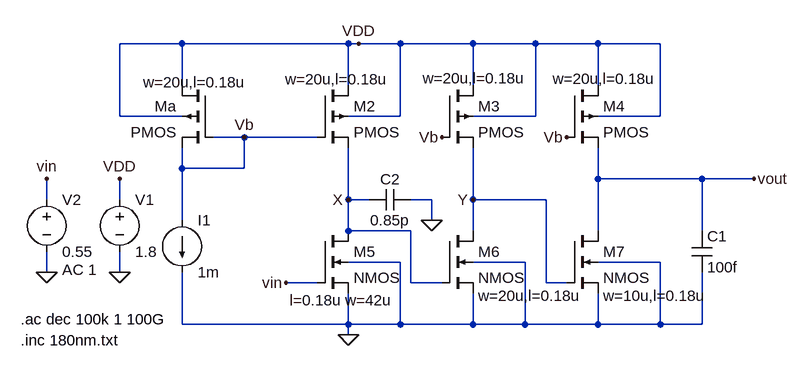
[diagram p0: schematic q4.asc]
q4.asc, the LTspice schematic file:
Version 4
SHEET 1 964 680
WIRE -112 -176 -208 -176
WIRE 144 -176 -112 -176
WIRE 160 -176 144 -176
WIRE 224 -176 160 -176
WIRE 336 -176 224 -176
WIRE 432 -176 336 -176
WIRE 528 -176 432 -176
WIRE 624 -176 528 -176
WIRE -112 -112 -112 -176
WIRE 144 -112 144 -176
WIRE 336 -112 336 -176
WIRE 528 -112 528 -176
WIRE -208 -64 -208 -176
WIRE -112 -64 -208 -64
WIRE 224 -64 224 -176
WIRE 224 -64 144 -64
WIRE 432 -64 432 -176
WIRE 432 -64 336 -64
WIRE 624 -64 624 -176
WIRE 624 -64 528 -64
WIRE -16 -32 -64 -32
WIRE 96 -32 -16 -32
WIRE -112 16 -112 -16
WIRE -16 16 -16 -32
WIRE -16 16 -112 16
WIRE 528 32 528 -16
WIRE 688 32 528 32
WIRE 768 32 688 32
WIRE -320 64 -320 32
WIRE -208 64 -208 32
WIRE 144 64 144 -16
WIRE 176 64 144 64
WIRE 272 64 240 64
WIRE 336 64 336 -16
WIRE 448 64 336 64
WIRE -112 96 -112 16
WIRE 272 96 272 64
WIRE 144 112 144 64
WIRE 240 112 144 112
WIRE 336 112 336 64
WIRE 528 112 528 32
WIRE 688 112 688 32
WIRE 224 160 144 160
WIRE 416 160 336 160
WIRE 624 160 528 160
WIRE -320 176 -320 144
WIRE -208 176 -208 144
WIRE 96 192 48 192
WIRE 240 192 240 112
WIRE 288 192 240 192
WIRE 448 192 448 64
WIRE 480 192 448 192
WIRE -112 256 -112 176
WIRE 144 256 144 208
WIRE 144 256 -112 256
WIRE 224 256 224 160
WIRE 224 256 144 256
WIRE 336 256 336 208
WIRE 336 256 224 256
WIRE 416 256 416 160
WIRE 416 256 336 256
WIRE 528 256 528 208
WIRE 528 256 416 256
WIRE 624 256 624 160
WIRE 624 256 528 256
WIRE 688 256 688 176
WIRE 688 256 624 256
WIRE 144 272 144 256
FLAG 160 -176 VDD
FLAG 144 272 0
FLAG 48 192 vin
FLAG 768 32 vout
FLAG 144 64 X
FLAG 336 64 Y
FLAG -208 176 0
FLAG -208 32 VDD
FLAG -320 176 0
FLAG -320 32 vin
FLAG -16 -32 Vb
FLAG 288 -32 Vb
FLAG 480 -32 Vb
FLAG 272 96 0
SYMBOL pmos4 -64 -112 M0
WINDOW 123 -51 -5 Left 2
SYMATTR InstName Ma
SYMATTR Value2 w=20u,l=0.18u
SYMBOL pmos4 96 -112 R0
WINDOW 123 -49 -9 Left 2
SYMATTR InstName M2
SYMATTR Value2 w=20u,l=0.18u
SYMBOL pmos4 288 -112 R0
WINDOW 123 -30 -11 Left 2
SYMATTR InstName M3
SYMATTR Value2 w=20u,l=0.18u
SYMBOL pmos4 480 -112 R0
WINDOW 123 -22 -10 Left 2
SYMATTR InstName M4
SYMATTR Value2 w=20u,l=0.18u
SYMBOL current -112 96 R0
WINDOW 123 0 0 Left 0
WINDOW 39 0 0 Left 0
SYMATTR InstName I1
SYMATTR Value 1m
SYMBOL nmos4 96 112 R0
WINDOW 123 -42 107 Left 2
SYMATTR InstName M5
SYMATTR Value2 l=0.18u w=42u
SYMBOL nmos4 288 112 R0
WINDOW 123 56 100 Left 2
SYMATTR InstName M6
SYMATTR Value2 w=20u,l=0.18u
SYMBOL nmos4 480 112 R0
WINDOW 123 56 100 Left 2
SYMATTR InstName M7
SYMATTR Value2 w=10u,l=0.18u
SYMBOL cap 672 112 R0
SYMATTR InstName C1
SYMATTR Value 100f
SYMBOL voltage -208 48 R0
SYMATTR InstName V1
SYMATTR Value 1.8
SYMBOL voltage -320 48 R0
WINDOW 123 24 124 Left 2
WINDOW 39 0 0 Left 0
SYMATTR Value2 AC 1
SYMATTR InstName V2
SYMATTR Value 0.55
SYMBOL cap 240 48 R90
WINDOW 0 0 32 VBottom 2
WINDOW 3 32 32 VTop 2
SYMATTR InstName C2
SYMATTR Value 0.85p
TEXT -360 248 Left 2 !.ac dec 100k 1 100G
TEXT -360 280 Left 2 !.inc 180nm.txt

The netlist it stands for:
* q4.asc
Ma VDD Vb Vb VDD PMOS w=20u,l=0.18u
M2 VDD Vb X VDD PMOS w=20u,l=0.18u
M3 VDD Vb Y VDD PMOS w=20u,l=0.18u
M4 VDD Vb vout VDD PMOS w=20u,l=0.18u
I1 Vb 0 1m
M5 X vin 0 0 NMOS l=0.18u w=42u
M6 Y X 0 0 NMOS w=20u,l=0.18u
M7 vout Y 0 0 NMOS w=10u,l=0.18u
C1 vout 0 100f
V1 VDD 0 1.8
V2 vin 0 0.55 AC 1
C2 0 X 0.85p
.model NMOS NMOS
.model PMOS PMOS
.lib standard.mos
.ac dec 100k 1 100G
.inc 180nm.txt
.backanno
.end

* Results of the author's LTspice run, read from the files saved beside the schematic
* Operating Point, zero values left out:
*   V(vdd) = 1.8 V
*   V(vb) = 1.065 V
*   V(x) = 558.6 mV
*   V(y) = 1.136 V
*   V(vout) = 152.4 mV
*   V(vin) = 550 mV
*   Id(M7) = 1.431 mA
*   Is(M7) = -1.431 mA
*   Id(M6) = 964.5 µA
*   Ib(M6) = -1.146 pA
*   Is(M6) = -964.5 µA
*   Id(M5) = 1.241 mA
*   Is(M5) = -1.241 mA
*   Id(M4) = 1.431 mA
*   Ib(M4) = 1.658 pA
*   Is(M4) = -1.431 mA
*   Id(M3) = 964.5 µA
*   Is(M3) = -964.5 µA
*   Id(M2) = 1.241 mA
*   Ib(M2) = 1.251 pA
*   Is(M2) = -1.241 mA
*   Id(Ma) = 1 mA
*   Is(Ma) = -1 mA
*   I(I1) = 1 mA
*   I(V1) = -4.636 mA